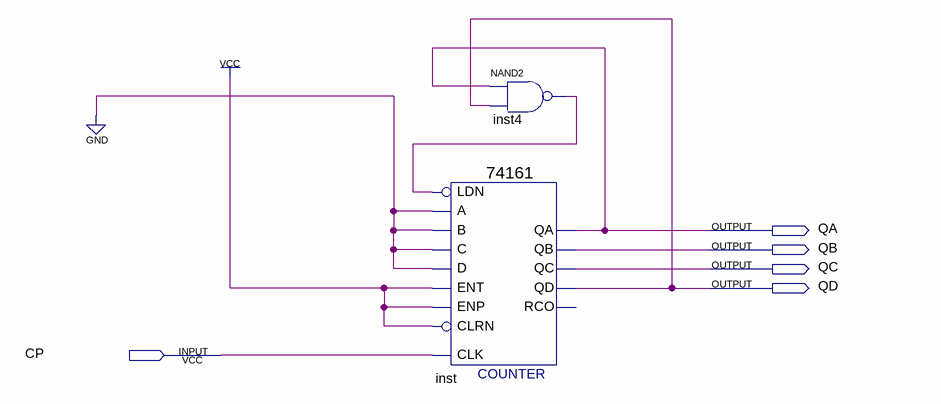
[diagram p0: schematic sheet]
// Quartus schematic 1.bdf as structural Verilog: 2 symbols, 5 pins
module \1  (
  input  CP,
  output QA,
  output QB,
  output QC,
  output QD
);

  wire inst4_out;

  \74161  inst (
    .CLRN(1'b1), .CLK(CP), .ENP(1'b1), .LDN(inst4_out), .A(1'b0), .D(1'b0), .ENT(1'b1), .B(1'b0), .C(1'b0),
    .QD(QD), .QC(QC), .QB(QB), .QA(QA));  // open: RCO
  nand inst4 (inst4_out, QA, QD);
endmodule
